# EAGLE design IR (EAGLE 9.6.2)
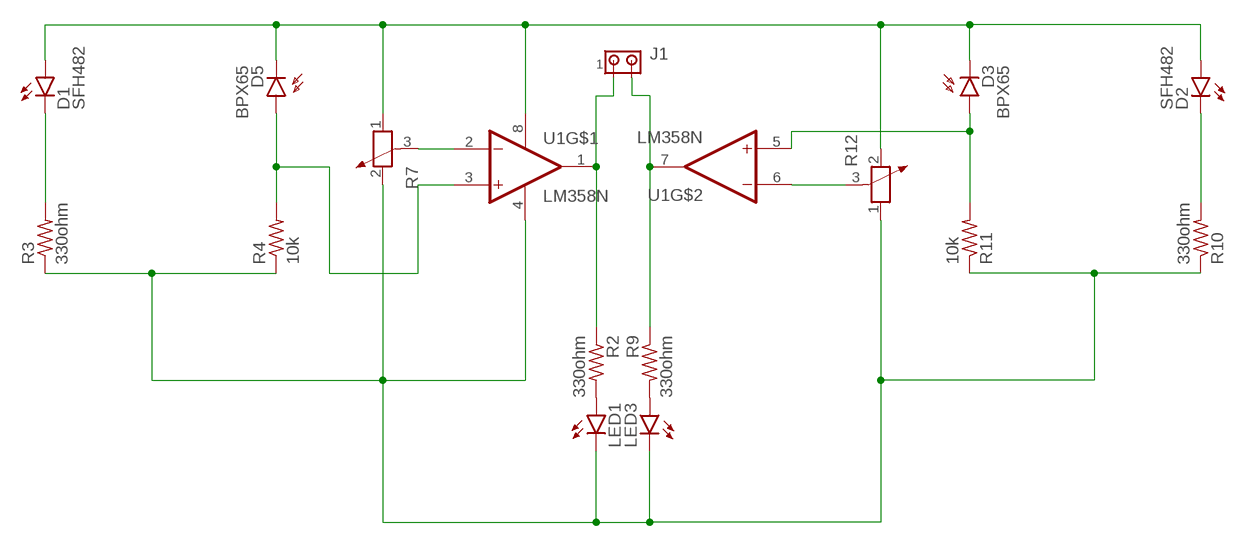
[diagram p0: schematic, sheet 1]

## Parts
D1  SFH482  [SFH482]
D2  SFH482  [SFH482]
D3  BPX65  [BPX65]
D5  BPX65  [BPX65]
J1  MTA02-100  [10X02MTA]
LED1  LED3MM  [LED3MM]
LED3  LED3MM  [LED3MM]
R2  330ohm  R-US_0204/5  [0204/5]
R3  330ohm  R-US_0204/5  [0204/5]
R4  10k  R-US_0204/5  [0204/5]
R7  POTENTIOMETER_PT-10  [PT-10]
R9  330ohm  R-US_0204/5  [0204/5]
R10  330ohm  R-US_0204/5  [0204/5]
R11  10k  R-US_0204/5  [0204/5]
R12  POTENTIOMETER_PT-10  [PT-10]
U1  LM358N  [DIP762W46P254L960H508Q8]

## Nets
N$1: D1.K(C) R3.2
N$2: D5.A R4.2 U1.3(1IN+)
N$3: D1.A D2.A D3.K(C) D5.K(C) R7.1 R12.2 U1.8(VCC)
N$4: LED1.K(C) LED3.K(C) R3.1 R4.1 R7.2 R10.1 R11.1 R12.1 U1.4(GND)
N$5: R7.3 U1.2(1IN-)
N$6: LED1.A R2.2
N$7: J1.1 R2.1 U1.1(1OUT)
N$8: D2.K(C) R10.2
N$9: R12.3 U1.6(2IN-)
N$11: D3.A R11.2 U1.5(2IN+)
N$13: J1.2 R9.1 U1.7(2OUT)
N$14: LED3.A R9.2

## Library data of the parts
D1 D2 = led:SFH482: IR LED infrared emitting diode, Infineon
D3 D5 = opto-trans-siemens:BPX65: PHOTO DIODE; MPN: BPX65.; OC_FARNELL: 327451; OC_NEWARK: 06WX2764
J1 = con-amp:MTA02-100: AMP connector
LED1 LED3 = led:LED: LED OSRAM: - CHIPLED LG R971, LG N971, LY N971, LG Q971, LY Q971, LO R971, LY R971 LH N974, LH R974 LS Q976, LO Q976, LY Q976 LO Q996 - Hyper CHIPLED LW Q18S LB Q993, LB Q99A, LB R99A - SideLED LS A670, LO A670, LY A670, LG A670, LP A670 LB A673, LV A673, LT A673, LW A673 LH A674 LY A675 LS A676, LA A676, LO A676, LY A676, LW A676 LS A679, LY A679, LG A679 - Hyper Micro SIDELED® LS Y876, LA Y876, LO Y876, LY Y876 LT Y87S - SmartLED LW L88C, LW L88S LB L89C, LB L89S, LG L890 LS L89K, LO L89K, LY L89K LS L896, LA L896, LO L896, LY L896 - TOPLED LS T670, LO T670, LY T670, LG T670, LP T670 LSG T670, LSP T670, LSY T670, LOP T670, LYG T670 LG T671, LOG T671, LSG T671 LB T673, LV T673, LT T673, LW T673 LH T674 LS T676, LA T676, LO T676, LY T676, LB T676, LH T676, LSB T676, LW T676 LB T67C, LV T67C, LT T67C, LS T67K, LO T67K, LY T67K, LW E67C LS E67B, LA E67B, LO E67B, LY E67B, LB E67C, LV E67C, LT E67C LW T67C LS T679, LY T679, LG T679 LS T770, LO T770, LY T770, LG T770, LP T770 LB T773, LV T773, LT T773, LW T773 LH T774 LS E675, LA E675, LY E675, LS T675 LS T776, LA T776, LO T776, LY T776, LB T776 LHGB T686 LT T68C, LB T68C - Hyper Mini TOPLED® LB M676 - Mini TOPLED Santana® LG M470 LS M47K, LO M47K, LY M47K Source: http://www.osram.convergy.de LUXEON: - LUMILED® LXK2-PW12-R00, LXK2-PW12-S00, LXK2-PW14-U00, LXK2-PW14-V00 LXK2-PM12-R00, LXK2-PM12-S00, LXK2-PM14-U00 LXK2-PE12-Q00, LXK2-PE12-R00, LXK2-PE12-S00, LXK2-PE14-T00, LXK2-PE14-U00 LXK2-PB12-K00, LXK2-PB12-L00, LXK2-PB12-M00, LXK2-PB14-N00, LXK2-PB14-P00, LXK2-PB14-Q00 LXK2-PR12-L00, LXK2-PR12-M00, LXK2-PR14-Q00, LXK2-PR14-R00 LXK2-PD12-Q00, LXK2-PD12-R00, LXK2-PD12-S00 LXK2-PH12-R00, LXK2-PH12-S00 LXK2-PL12-P00, LXK2-PL12-Q00, LXK2-PL12-R00 Source: www.luxeon.com KINGBRIGHT: KA-3528ASYC Source: www.kingbright.com
R2-R4 R9-R11 = rcl:R-US_: RESISTOR, American symbol; SPICEPREFIX: R
R7 R12 = rcl:POTENTIOMETER_: Potentiometer; SPICEMODEL: POT; SPICEPREFIX: X
U1 = LM358N:LM358N: IC OPAMP GP 2 CIRCUIT 8DIP Check availability <https://pricing.snapeda.com/parts/LM358N/Harris%20Corporation/view-part?ref=eda>; AVAILABILITY: Not in stock; CHECK_PRICES: https://www.snapeda.com/parts/LM358N/Harris/view-part/?ref=eda; DESCRIPTION: General Purpose Amplifier 2 Circuit 8-PDIP; MF: Harris Corporation; MP: LM358N; PACKAGE: None; PRICE: None; SNAPEDA_LINK: https://www.snapeda.com/parts/LM358N/Harris/view-part/?ref=snap

## Board
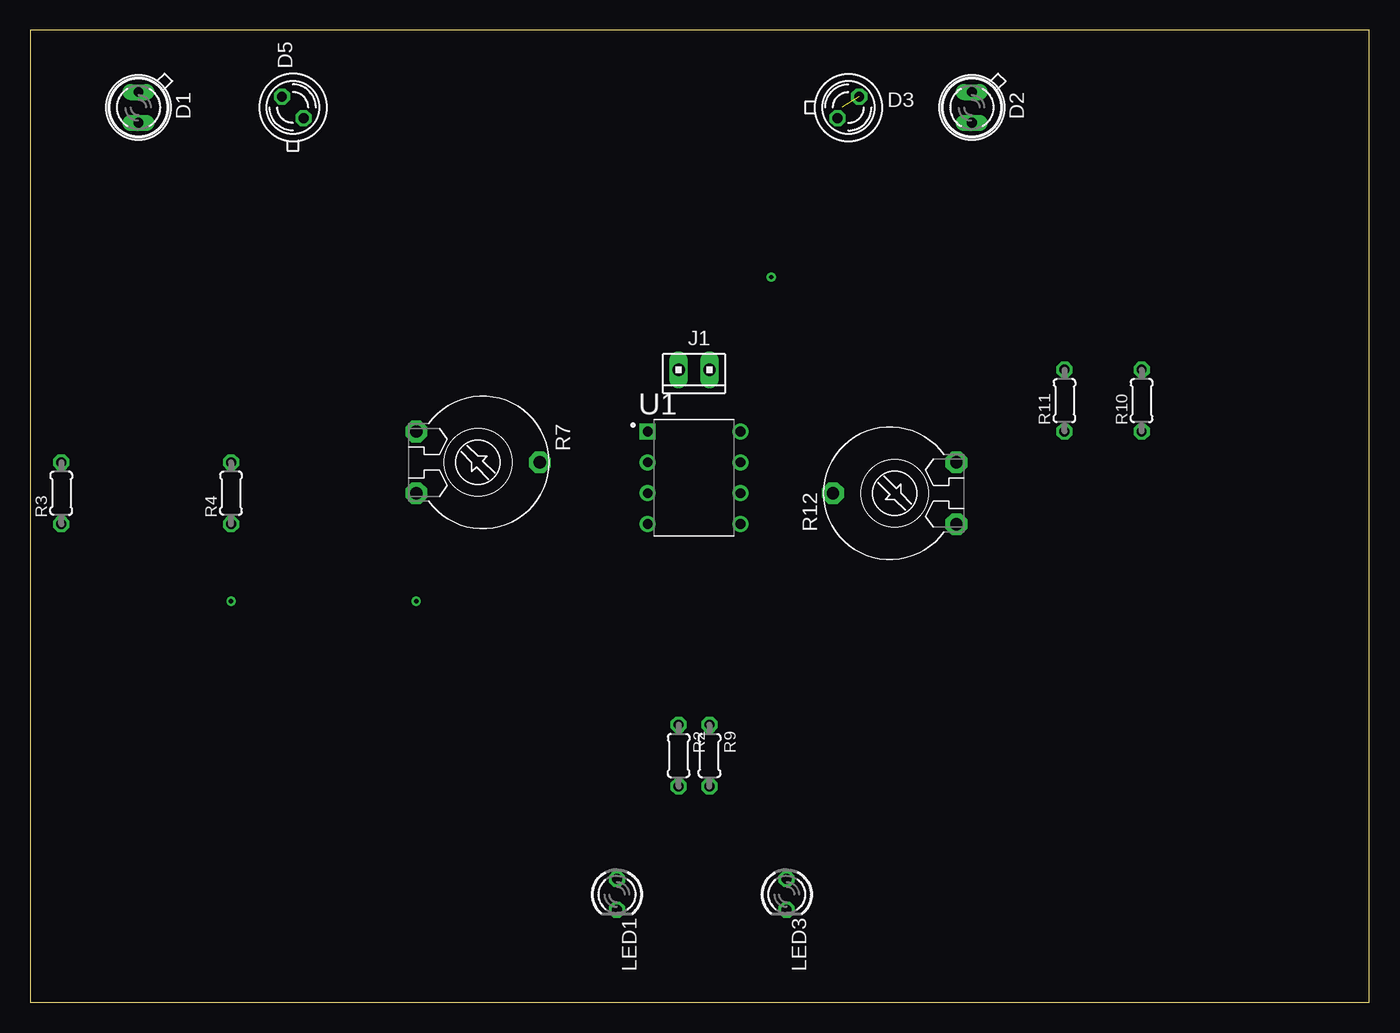
[diagram p1: board, top side]
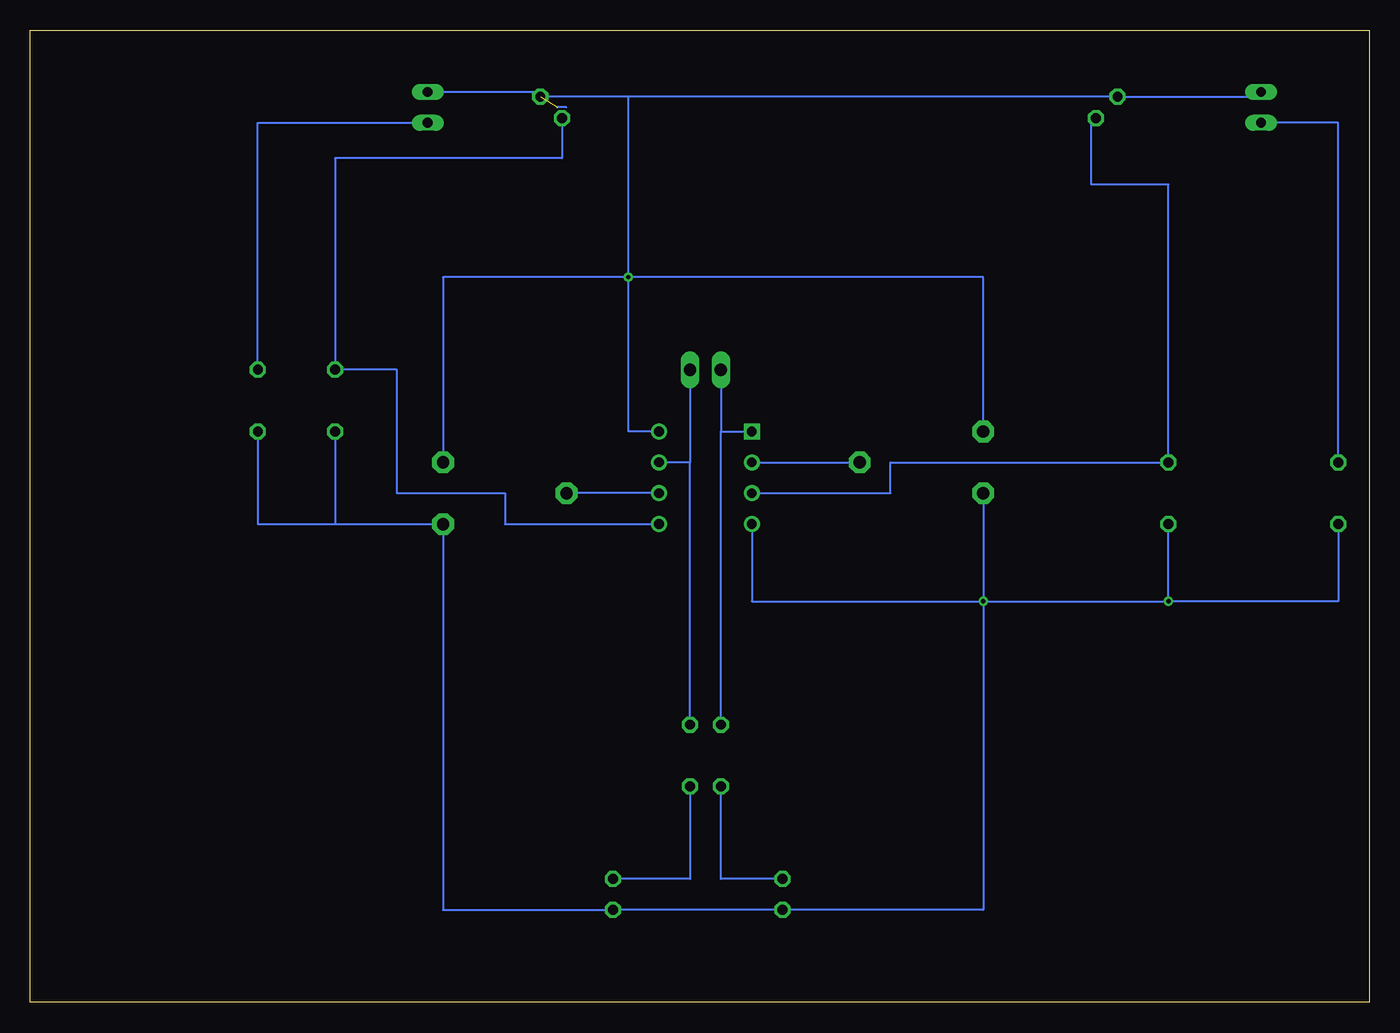
[diagram p2: board, bottom side, seen from below]

Size 110.16 x 80 mm. Coordinates in mm from the lower left corner, seen from the top.
Outline: 0,0 110.16,0 110.16,80 0,80 0,0
Copper layers (1*16): Top 0.035mm / dielectric 1.5mm / Bottom 0.035mm
Design rules "default": minimum track width 6mil, minimum drill 0.35mm, track to track 6mil, track to pad 6mil, pad to pad 6mil, via to via 6mil, smd to smd 6mil, copper to edge 40mil, drill to drill 6mil, minimum pad ring 10mil, minimum via ring 8mil, stop-mask expansion 4mil, vias tented up to drill 0mil, thermal gap 10mil

### Footprints (pad centres in the part's own frame; a part is rotated, then mirrored left to right if it is on the bottom)
SFH482 = drill 0.813 long: A -1.27,0; K 1.27,0
BPX65 = drill 0.813 octagon: A -0.889,-0.889; K 0.889,0.889
10X02MTA = drill 1.016 long: 1 1.27,0; 2 -1.27,0
LED3MM = drill 0.813 octagon: A -1.27,0; K 1.27,0
0204/5 = drill 0.813 octagon: 1 -2.54,0; 2 2.54,0
PT-10 = drill 1.016 pad 1.778 octagon: 1 -2.54,-5.08; 2 2.54,-5.08; 3 0,5.08
DIP762W46P254L960H508Q8 = drill 0.81 pad 1.22 square: 1 -3.81,3.81 | drill 0.81 pad 1.22: 2 -3.81,1.27; 3 -3.81,-1.27; 4 -3.81,-3.81; 5 3.81,-3.81; 6 3.81,-1.27; 7 3.81,1.27; 8 3.81,3.81

### Placement (x,y rotation side)
D1  8.89,73.66 270 top
D2  77.47,73.66 270 top
D3  67.31,73.66 0 top
D5  21.59,73.66 90 top
J1  54.61,52.07 180 top
LED1  48.26,8.89 270 top
LED3  62.23,8.89 270 top
R2  53.34,20.32 270 top
R3  2.54,41.91 90 top
R4  16.51,41.91 90 top
R7  36.83,44.45 270 top
R9  55.88,20.32 270 top
R10  91.44,49.53 90 top
R11  85.09,49.53 90 top
R12  71.12,41.91 90 top
U1  54.61,43.18 0 top

### Tracks (layer width: path | path; a pad name or v marks a point on that pad's centre or on a via)
N$1
  Bottom 0.152: R3.2 2.54,72.39 D1.K
N$2
  Bottom 0.152: D5.A 22.86,72.39 22.86,67.31 16.51,67.31 R4.2 39.37,44.45 39.37,41.91 U1.3
N$3  (via drill 0.35)  (1 unrouted)
  Bottom 0.152: D1.A 9.27,74.55 D5.K 60.96,74.55 | 60.96,74.55 D3.K 68.58,74.93 D2.A | v60.96,59.69 60.96,46.99 U1.8 | v60.96,59.69 60.96,74.55 | 66.05,73.66 66.79,73.66 | R7.1 31.75,59.69 v60.96,59.69 | v60.96,59.69 76.2,59.69 R12.2
N$4  (via drill 0.35)
  Bottom 0.152: R3.1 2.54,33.02 v16.51,33.02 | v16.51,33.02 R4.1 | v31.75,33.02 v16.51,33.02 | R7.2 v31.75,33.02 | R10.1 91.44,39.37 85.09,39.37 | R11.1 85.09,39.37 | 85.09,39.37 R12.1 76.2,7.62 LED3.K LED1.K 31.75,7.62 v31.75,33.02 | U1.4 50.8,33.02 v31.75,33.02
N$5
  Bottom 0.152: U1.2 R7.3
N$6
  Bottom 0.152: LED1.A 53.34,10.16 R2.2
N$7
  Bottom 0.152: J1.1 53.34,46.99 | 53.34,46.99 U1.1 | R2.1 53.34,46.99
N$8
  Bottom 0.152: R10.2 91.44,72.39 D2.K
N$9
  Bottom 0.152: U1.6 R12.3
N$11
  Bottom 0.152: D3.A 66.42,69.47 85.09,69.47 R11.2 80.01,52.07 80.01,41.91 71.12,41.91 71.12,39.37 U1.5
N$13
  Bottom 0.152: J1.2 55.88,44.45 | 55.88,44.45 U1.7 | R9.1 55.88,44.45
N$14
  Bottom 0.152: R9.2 55.88,10.16 LED3.A